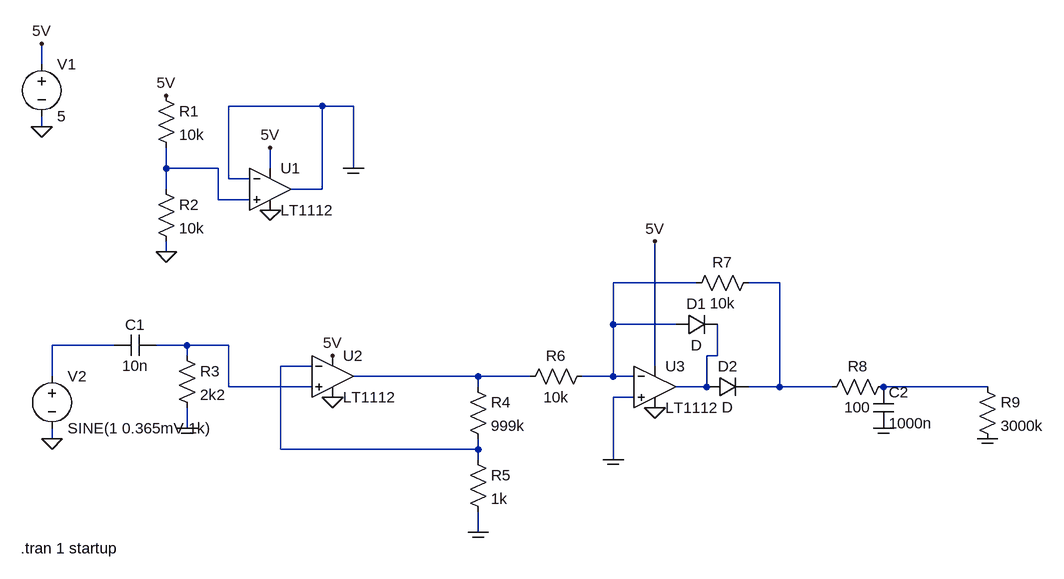
[diagram p0: schematic mikver.asc]
mikver.asc, the LTspice schematic file:
Version 4
SHEET 1 1440 728
WIRE -112 -32 -112 -64
WIRE 320 32 176 32
WIRE 368 32 320 32
WIRE -112 64 -112 48
WIRE 80 128 80 96
WIRE 160 128 80 128
WIRE 240 128 240 96
WIRE 368 128 368 32
WIRE 176 144 176 32
WIRE 208 144 176 144
WIRE 80 160 80 128
WIRE 320 160 320 32
WIRE 320 160 272 160
WIRE 160 176 160 128
WIRE 208 176 160 176
WIRE 80 256 80 240
WIRE 896 304 768 304
WIRE 1024 304 976 304
WIRE 768 368 768 304
WIRE 864 368 768 368
WIRE 0 400 -96 400
WIRE 112 400 64 400
WIRE 176 400 112 400
WIRE 112 416 112 400
WIRE 928 416 928 368
WIRE 928 416 912 416
WIRE 304 432 256 432
WIRE 832 432 832 240
WIRE -96 448 -96 400
WIRE 560 448 368 448
WIRE 640 448 560 448
WIRE 768 448 768 368
WIRE 768 448 720 448
WIRE 800 448 768 448
WIRE 176 464 176 400
WIRE 304 464 176 464
WIRE 560 464 560 448
WIRE 912 464 912 416
WIRE 912 464 864 464
WIRE 1024 464 1024 304
WIRE 1024 464 976 464
WIRE 1104 464 1024 464
WIRE 1344 464 1184 464
WIRE 800 480 768 480
WIRE 112 528 112 496
WIRE -96 544 -96 528
WIRE 256 560 256 432
WIRE 560 560 560 544
WIRE 560 560 256 560
WIRE 560 576 560 560
WIRE 768 576 768 480
WIRE 560 688 560 656
FLAG -112 64 0
FLAG -112 -64 5V
FLAG 240 96 5V
FLAG 80 16 5V
FLAG 336 416 5V
FLAG 80 256 0
FLAG 240 192 0
FLAG 336 480 0
FLAG 368 128 COM
FLAG 112 528 COM
FLAG -96 544 0
FLAG 560 688 COM
FLAG 768 576 COM
FLAG 832 240 5V
FLAG 832 496 0
FLAG 1184 528 COM
FLAG 1344 544 COM
DATAFLAG 352 32 ""
SYMBOL voltage -112 -48 R0
WINDOW 123 0 0 Left 2
WINDOW 39 0 0 Left 2
SYMATTR InstName V1
SYMATTR Value 5
SYMBOL Opamps\\LT1112 240 96 R0
SYMATTR InstName U1
SYMBOL Opamps\\LT1112 336 384 R0
SYMATTR InstName U2
SYMBOL res 64 0 R0
SYMATTR InstName R1
SYMATTR Value 10k
SYMBOL res 64 144 R0
SYMATTR InstName R2
SYMATTR Value 10k
SYMBOL voltage -96 432 R0
WINDOW 123 0 0 Left 2
WINDOW 39 0 0 Left 2
SYMATTR InstName V2
SYMATTR Value SINE(1 0.365mV 1k)
SYMBOL cap 64 384 R90
WINDOW 0 0 32 VBottom 2
WINDOW 3 32 32 VTop 2
SYMATTR InstName C1
SYMATTR Value 10n
SYMBOL res 96 400 R0
SYMATTR InstName R3
SYMATTR Value 2k2
SYMBOL res 544 448 R0
SYMATTR InstName R4
SYMATTR Value 999k
SYMBOL res 544 560 R0
SYMATTR InstName R5
SYMATTR Value 1k
SYMBOL Opamps\\LT1112 832 400 R0
SYMATTR InstName U3
SYMBOL res 736 432 R90
WINDOW 0 0 56 VBottom 2
WINDOW 3 32 56 VTop 2
SYMATTR InstName R6
SYMATTR Value 10k
SYMBOL res 992 288 R90
WINDOW 0 0 56 VBottom 2
WINDOW 3 32 56 VTop 2
SYMATTR InstName R7
SYMATTR Value 10k
SYMBOL diode 864 384 R270
WINDOW 0 32 32 VTop 2
WINDOW 3 0 32 VBottom 2
SYMATTR InstName D1
SYMBOL diode 912 480 R270
WINDOW 0 32 32 VTop 2
WINDOW 3 0 32 VBottom 2
SYMATTR InstName D2
SYMBOL res 1200 448 R90
WINDOW 0 0 56 VBottom 2
WINDOW 3 32 56 VTop 2
SYMATTR InstName R8
SYMATTR Value 100
SYMBOL cap 1168 464 R0
SYMATTR InstName C2
SYMATTR Value 1000n
SYMBOL res 1328 448 R0
SYMATTR InstName R9
SYMATTR Value 3000k
TEXT -144 712 Left 2 !.tran 1 startup

The netlist it stands for:
* mikver.asc
V1 5V 0 5
XU1 N001 COM 5V 0 COM LT1112  ; pins In+ In- V+ V- OUT
XU2 N005 N007 5V 0 N008 LT1112  ; pins In+ In- V+ V- OUT
R1 5V N001 10k
R2 N001 0 10k
V2 N004 0 SINE(1 0.365mV 1k)
C1 N005 N004 10n
R3 N005 COM 2k2
R4 N008 N007 999k
R5 N007 COM 1k
XU3 COM N002 5V 0 N006 LT1112  ; pins In+ In- V+ V- OUT
R6 N002 N008 10k
R7 N003 N002 10k
D1 N002 N006 D
D2 N006 N003 D
R8 N009 N003 100
C2 N009 COM 1000n
R9 N009 COM 3000k
.model D D
.lib standard.dio
.tran 1 startup
.lib LTC.lib
.backanno
.end